# Altium schematic sheet USB-C-Control.SchDoc: =ProjectTitle
size 297 x 209 mm; Address1: Address1; Address2: Address2; Address3: Address3; Address4: Address4; SheetNumber: 9; SheetTotal: 17; Scale: 1:1; DocumentType: Схема электрическая принципиальная
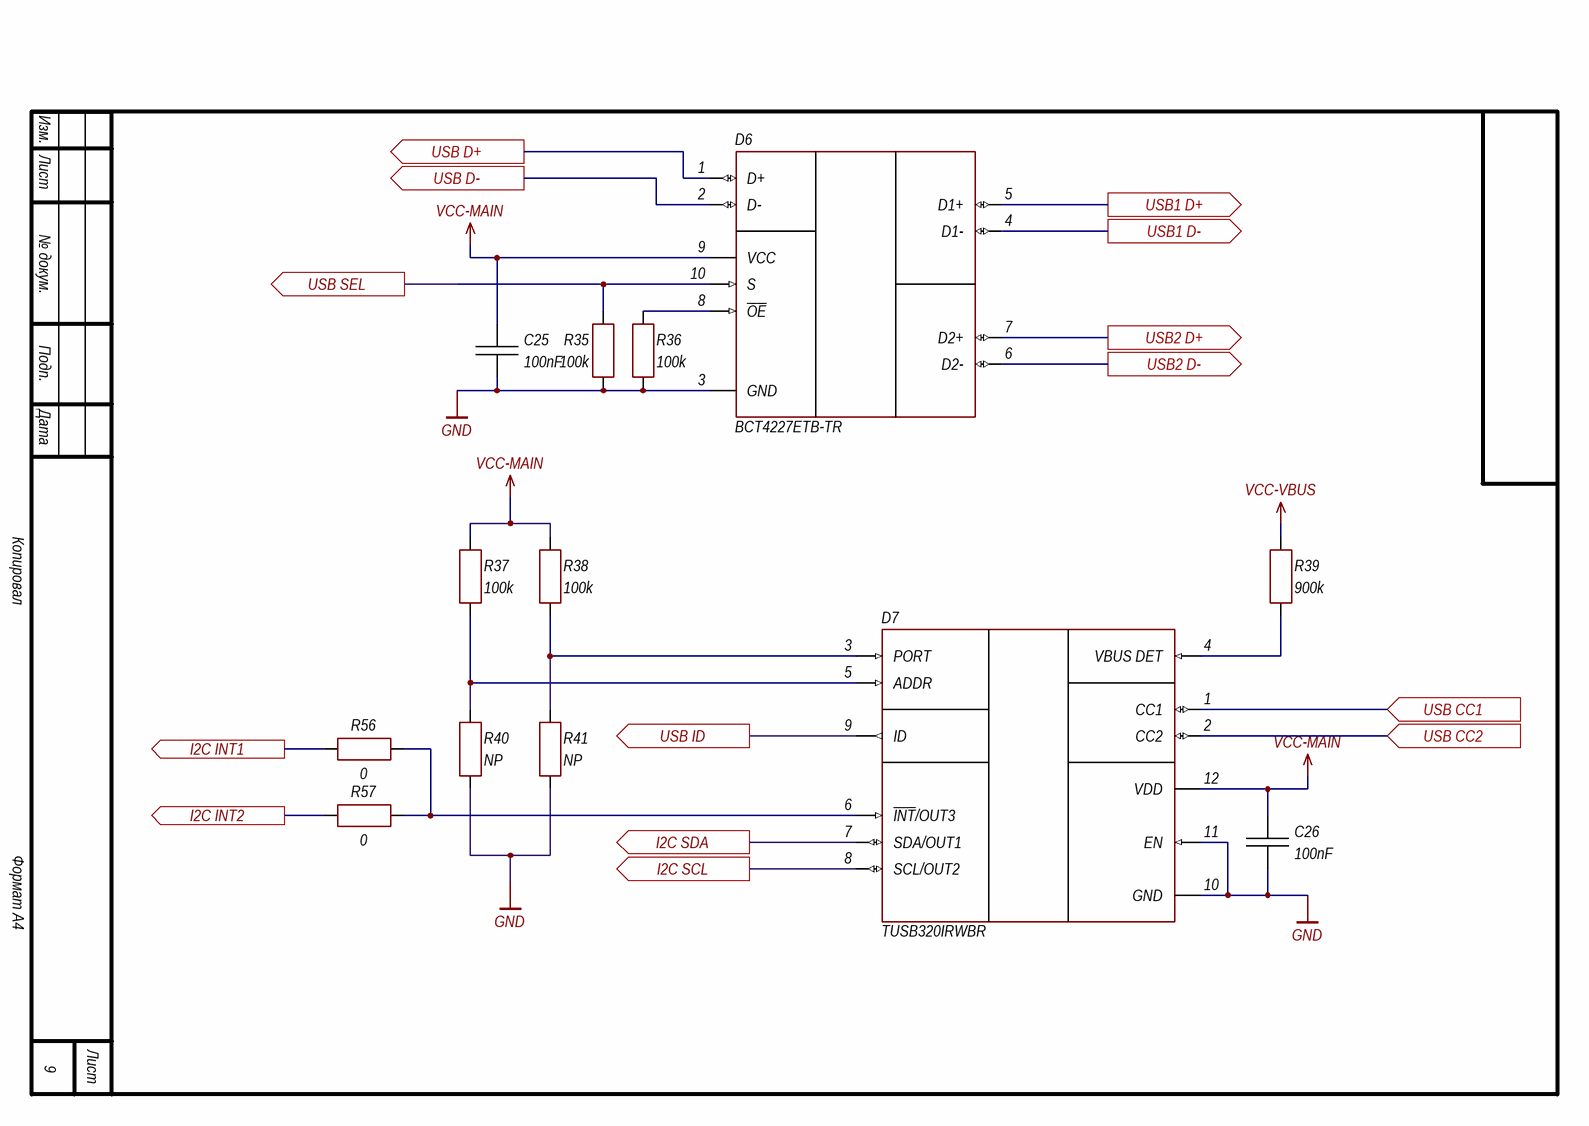
[diagram p0: USB-C-Control.SchDoc]

## Parts
C25  100nF  [CH0402C]
C26  100nF  [CH0402C]
D6  BCT4227ETB-TR  [10-UQFN]
D7  TUSB320IRWBR  [12-X2QFN]
R35  100k  [CH0402R]
R36  100k  [CH0402R]
R37  100k  [CH0402R]
R38  100k  [CH0402R]
R39  900k  [CH0402R]
R40  NP  [CH0402R]
R41  NP  [CH0402R]
R56  0  [CH0402R]
R57  0  [CH0402R]

## Ports
I2C INT1 (out), I2C INT2 (out), I2C SCL (out), I2C SDA (out), USB1 D+ (out), USB1 D- (out), USB2 D+ (out), USB2 D- (out), USB CC1 (in), USB CC2 (in), USB D+ (out), USB D- (out), USB ID (out), USB SEL (out)

## Nets
GND: C25.1 C26.1 D6.3(GND) D7.10(GND) D7.11(EN) R35.1 R36.1 R40.1 R41.1
VCC-MAIN: C25.2 C26.2 D6.9(VCC) D7.12(VDD) R37.2 R38.2
VCC-VBUS: R39.2
I2C INT1: R56.1 ; port I2C INT1
I2C INT2: R57.1 ; port I2C INT2
I2C SCL: D7.8(SCL/OUT2) ; port I2C SCL
I2C SDA: D7.7(SDA/OUT1) ; port I2C SDA
USB1 D+: D6.5(D1+) ; port USB1 D+
USB1 D-: D6.4(D1-) ; port USB1 D-
USB2 D+: D6.7(D2+) ; port USB2 D+
USB2 D-: D6.6(D2-) ; port USB2 D-
USB CC1: D7.1(CC1) ; port USB CC1
USB CC2: D7.2(CC2) ; port USB CC2
USB D+: D6.1(D+) ; port USB D+
USB D-: D6.2(D-) ; port USB D-
USB ID: D7.9(ID) ; port USB ID
USB SEL: D6.10(S) R35.2 ; port USB SEL
NetD6_8: D6.8(~{OE}) R36.2
NetD7_3: D7.3(PORT) R38.1 R41.2
NetD7_4: D7.4(VBUS_DET) R39.1
NetD7_5: D7.5(ADDR) R37.1 R40.2
NetD7_6: D7.6(~{INT}/OUT3) R56.2 R57.2

## Notes on the sheet
- Изм.
- Лист
- № докум.
- Подп.
- Дата
- Копировал
- Формат А4

## Library data of the parts
C25 C26 = Capacitor: Manufacturer: *; Model: *; HelpURL: *; ComponentKind: *; Value: 100nF
D6 = BCT4227ETB-TR: USB 2.0 1:2 Mux/Demux; Manufacturer: BROADCHIP; HelpURL: https://www.lcsc.com/product-detail/Analog-Switches_BROADCHIP-BCT4227ETB-TR_C266762.html; ComponentKind: USB 2.0 1:2 Mux/Demux; Model: BCT4227ETB-TR
D7 = TUSB320: USB-C Port I2C controller (USB OTG); Manufacturer: Texas Instruments; HelpURL: https://datasheet.lcsc.com/lcsc/1912111437_Texas-Instruments-TUSB320HAIRWBR_C414628.pdf; ComponentKind: USB-C Port I2C controller USB OTG; Model: TUSB320IRWBR
R35-R39 R56 R57 = Resistor: Manufacturer: *; Model: *; HelpURL: *; ComponentKind: *
  R35-R38: Value: 100k
  R39: Value: 900k
  R56 R57: Value: 0
R40 R41 = Resistor: Value: 100k; Manufacturer: *; Model: *; HelpURL: *; ComponentKind: *; NP: NP